# Altium project Photoelectric effect to Ammeter.PrjPCB
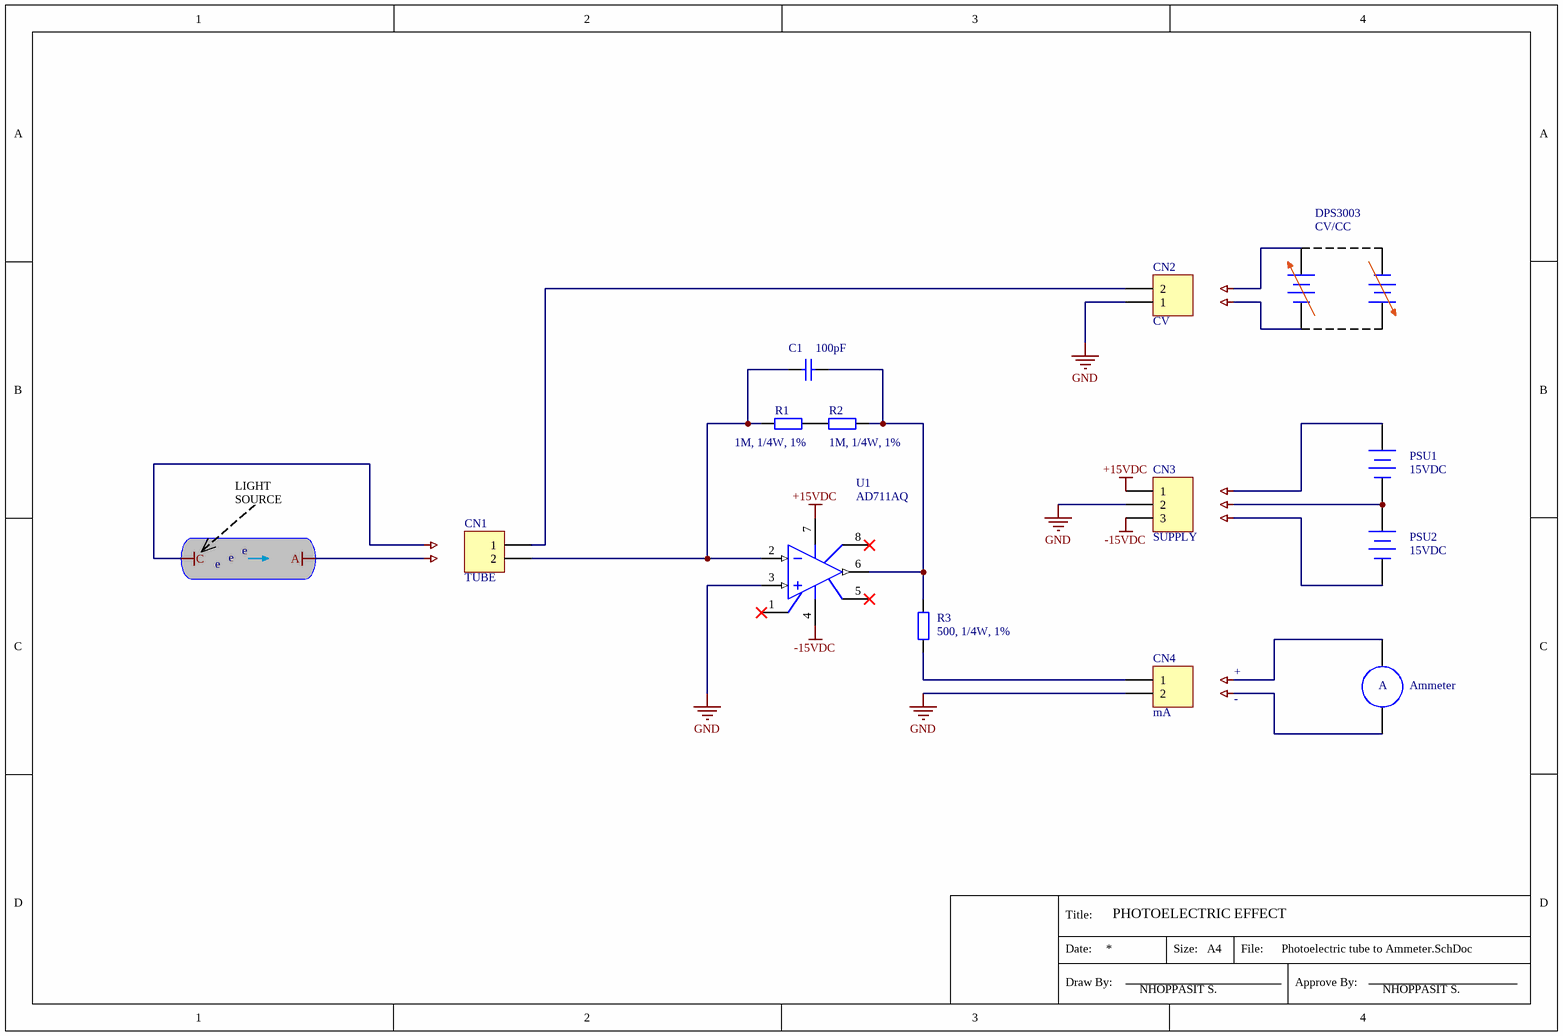
[diagram p0: Photoelectric tube to Ammeter.SchDoc]
1 sheet, 14 parts. Net scope: global (net labels, ports and power ports of the same name join across sheets).
Board file: Photoelectric tube to Ammeter 02.PcbDoc

## Sheet Photoelectric tube to Ammeter.SchDoc: PHOTOELECTRIC EFFECT
size A4; ApprovedBy: NHOPPASIT S.; CheckedBy: NHOPPASIT S.; Author: NHOPPASIT S.; DrawnBy: NHOPPASIT S.; Revision: 1; SheetNumber: 1; SheetTotal: 1; Size: A4; PageSetup: Record=PageOptions|CenterHorizontal=True|CenterVertical=True|PrintScale=0.98|XCorrection=1.00|YCorrection=1.00|PrintKind=0|BorderSize=5000000|LeftOffset=0|BottomOffset=0|Orientation=2|PaperLength=2970|PaperWidth=2100|Scale=100|PaperSource=7|PrintQuality=-3|MediaType=1|DitherType=10|PrintScaleMode=1|PaperKind=A4 (8.3 x 11.7 in)|PaperIndex=9

### Parts
Ammeter  A
C1  100pF  [C.2]
CN1  TUBE  [DG126-5.0 2P]
CN2  CV  [DG126-5.0 2P]
CN3  SUPPLY  [DG126-5.0 3P]
CN4  mA  [DG126-5.0 2P]
CV/CC  DPS3003
PSU0  15VDC  (value not drawn)
PSU1  15VDC
PSU2  15VDC
R1  1M, 1/4W, 1%  [AXIAL-0.4]
R2  1M, 1/4W, 1%  [AXIAL-0.4]
R3  500, 1/4W, 1%  [AXIAL-0.4]
U1  AD711AQ  [DIP-8]

### Nets
+15VDC: CN3.1 U1.7(V+)
-15VDC: CN3.3 U1.4(V-)
A: Ammeter.1 Ammeter.2 CV/CC.1(+) CV/CC.2(-) PSU1.1(+) PSU1.2(-) PSU2.1(+) PSU2.2(-)  [also labelled C, VCC]
GND: CN2.1 CN3.2 CN4.2 U1.3(IN+)
NetC1_1: C1.1 CN1.2 R1.1 U1.2(IN-)
NetC1_2: C1.2 R2.2 R3.2 U1.6(OUT)
NetCN1_1: CN1.1 CN2.2
NetCN4_1: CN4.1 R3.1
NetR1_2: R1.2 R2.1

Not connected (* = marked no-connect by the designer): PSU0 1(+) 2(-); U1 1(OS_NULL)* 5(OS_NULL)* 8(NC)*

### Notes on the sheet
- LIGHT SOURCE
- e
- +
- -
- Title:
- Date:
- Draw By:
- Size:
- File:
- Approve By:

### Library data of the parts
Ammeter = Meter: Indicating Instrument; Note: Place a "letter" into the symbol to show the function of the meter or instrument; Published: 24-Mar-1999; LatestRevisionDate: 17-Jul-2002; LatestRevisionNote: Re-released for DXP Platform.; PackageReference: RAD-0.1; Publisher: Altium Limited; PackageDescription: Radial Cap, Thru-Hole; 2 Leads; 0.1 in Pin Spacing
C1 = Cap: Capacitor; Published: 8-Jun-2000; LatestRevisionDate: 17-Jul-2002; LatestRevisionNote: Re-released for DXP Platform.; PackageReference: RAD-0.3; Publisher: Altium Limited; PackageDescription: Radial Cap, Thru-Hole; 2 Leads; 0.3 in Pin Spacing; Value: 100pF; Link: https://www.es.co.th/detail.asp?Prod=016003985
CN1 CN2 CN4 = Header 2H: Header, 2-Pin, Right Angle; LatestRevisionDate: 17-Jul-2002; LatestRevisionNote: Re-released for DXP Platform.; Publisher: Altium Limited; Link: https://www.es.co.th/detail.asp?Prod=033001717
CN3 = Header 3H: Header, 3-Pin, Right Angle; LatestRevisionDate: 17-Jul-2002; LatestRevisionNote: Re-released for DXP Platform.; Publisher: Altium Limited; Link: https://www.es.co.th/detail.asp?Prod=033000494
CV/CC PSU0-PSU2 = Battery: Multicell Battery; Published: 24-Mar-1999; LatestRevisionDate: 17-Jul-2002; LatestRevisionNote: Re-released for DXP Platform.; PackageReference: BAT-2; Publisher: Altium Limited; PackageDescription: Battery; 2 Leads
R1-R3 = Res2: Resistor; Published: 8-Jun-2000; LatestRevisionDate: 17-Jul-2002; LatestRevisionNote: Re-released for DXP Platform.; PackageReference: AXIAL-0.4; Publisher: Altium Limited; PackageDescription: Axial Device, Thru-Hole; 2 Leads; 0.4 in Pin Spacing
  R1 R2: Value: 1M, 1/4W, 1%
  R3: Value: 500, 1/4W, 1%
U1 = AD711AQ: Precision Low Cost High-Speed BiFET Operational Amplifier; Note: Pin 8 is not connected.; Published: 8-Jun-2000; LatestRevisionDate: 04-Mar-2005; LatestRevisionNote: Stylized 3D Model Added.; DatasheetVersion: REV. A; PackageVersion: 1998; PackageReference: Q-8; Publisher: Altium Limited; PackageDescription: DIP; 8 Leads; Row Spacing 7.62 mm; Pitch 2.54 mm; ComponentLink1Description: Manufacturer Link; ComponentLink1URL: http://www.analog.com/en/prod/0,,759_786_AD711%2C00.html; ComponentLink2Description: Datasheet; ComponentLink2URL: http://www.analog.com/UploadedFiles/Data_Sheets/155509409AD711_e.pdf